# EAGLE design n64-breakout (EAGLE 7.5.0)
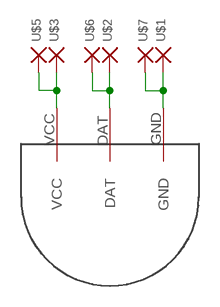
[diagram p0: schematic, sheet 1]

## Parts
U$1  SMDPADSMD6080  [SMD6080]
U$2  SMDPADSMD6080  [SMD6080]
U$3  SMDPADSMD6080  [SMD6080]
U$4  N64-CONNECTOR  [N64-CONNECTOR]
U$5  SMDPADSMD6080  [SMD6080]
U$6  SMDPADSMD6080  [SMD6080]
U$7  SMDPADSMD6080  [SMD6080]

## Nets
DAT: U$2.P$1(P) U$4.DAT U$6.P$1(P)
GND: U$1.P$1(P) U$4.GND U$7.P$1(P)
VCC: U$3.P$1(P) U$4.VCC U$5.P$1(P)

## Library data of the parts
U$1-U$3 U$5-U$7 = frank:SMDPAD
U$4 = munia-breakouts:N64-CONNECTOR

## Board
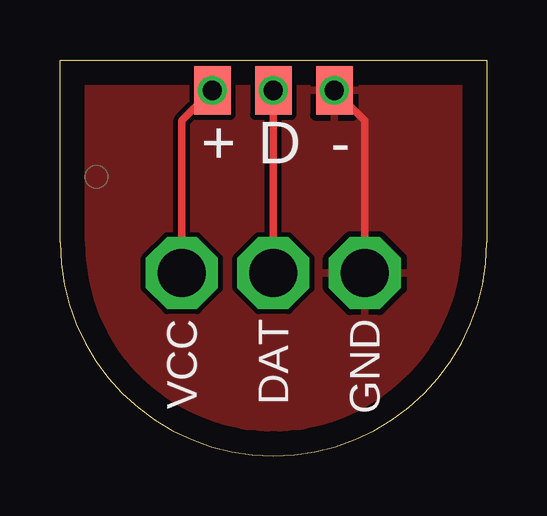
[diagram p1: board, top side]
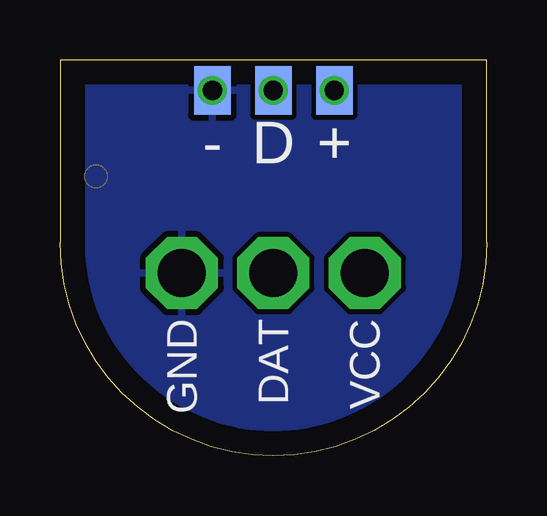
[diagram p2: board, bottom side, seen from below]

Size 17.78 x 16.51 mm. Coordinates in mm from the lower left corner, seen from the top.
Outline: 0,8.89 arc180 17.78,8.89 17.78,16.51 0,16.51 0,8.89
Copper layers (1*16): Top 0.035mm / dielectric 1.5mm / Bottom 0.035mm
Design rules "default": minimum track width 10mil, minimum drill 24mil, track to track 8mil, track to pad 8mil, pad to pad 8mil, via to via 8mil, smd to smd 8mil, copper to edge 40mil, drill to drill 8mil, minimum pad ring 10mil, minimum via ring 8mil, stop-mask expansion 4mil, vias tented up to drill 0mil, thermal gap 10mil

### Footprints (pad centres in the part's own frame; a part is rotated, then mirrored left to right if it is on the bottom)
SMD6080 = smd 1.524 x 2.032: P$1 0,0
N64-CONNECTOR = drill 2 octagon: DAT 0,0; GND -3.81,0; VCC 3.81,0

### Placement (x,y rotation side)
U$1  11.43,15.24 0 top
U$2  8.89,15.24 0 top
U$3  6.35,15.24 0 top
U$4  8.89,7.62 0 bottom
U$5  6.35,15.24 0 bottom
U$6  8.89,15.24 0 bottom
U$7  11.43,15.24 0 bottom

### Tracks (layer width: path | path; a pad name or v marks a point on that pad's centre or on a via)
DAT  (via drill 0.8)
  Top 0.305: U$4.DAT U$6.P$1
  other vias: 8.89,15.24
GND  (via drill 0.8)
  Top 0.305: U$4.GND 12.7,13.97 U$7.P$1
  other vias: 11.43,15.24
  pour Bottom: -1.27,17.78 -1.27,-1.27 20.32,-1.27 20.32,17.78
  pour Top: -1.27,17.78 -1.27,-1.27 20.32,-1.27 20.32,17.78
VCC  (via drill 0.8)
  Top 0.305: U$4.VCC 5.08,13.97 U$5.P$1
  other vias: 6.35,15.24

### Text on the board
tNames: + | D | -
bNames: + | D | -
tDocu: c 2016 / MUNIA.io
bDocu: c 2016 / MUNIA.io